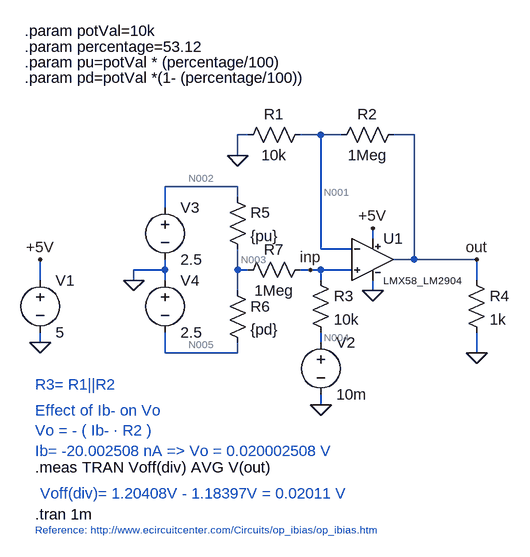
[diagram p0: schematic 05-LM358 ti bias current and offset voltage - non-inv amp.asc]
05-LM358 ti bias current and offset voltage - non-inv amp.asc, the LTspice schematic file:
Version 4
SHEET 1 880 688
WIRE 160 32 144 32
WIRE 272 32 240 32
WIRE 304 32 272 32
WIRE 416 32 384 32
WIRE 144 64 144 32
WIRE 144 112 32 112
WIRE 144 128 144 112
WIRE 32 144 32 112
WIRE 352 192 352 176
WIRE 272 208 272 32
WIRE 320 208 272 208
WIRE 416 224 416 32
WIRE 416 224 384 224
WIRE 512 224 416 224
WIRE 32 240 32 224
WIRE 32 240 -16 240
WIRE 144 240 144 208
WIRE 160 240 144 240
WIRE 256 240 240 240
WIRE 272 240 256 240
WIRE 320 240 272 240
WIRE -160 256 -160 224
WIRE -16 256 -16 240
WIRE 32 256 32 240
WIRE 272 256 272 240
WIRE 512 256 512 224
WIRE 144 272 144 240
WIRE 352 272 352 256
WIRE -160 352 -160 336
WIRE 272 352 272 336
WIRE 32 368 32 336
WIRE 144 368 144 352
WIRE 144 368 32 368
WIRE 512 368 512 336
WIRE 272 448 272 432
FLAG -160 224 +5V
FLAG 352 176 +5V
FLAG 272 448 0
FLAG 512 368 0
FLAG 512 224 out
FLAG 256 240 inp
FLAG 144 64 0
FLAG -160 352 0
FLAG 352 272 0
FLAG -16 256 0
SYMBOL voltage -160 240 R0
WINDOW 123 0 0 Left 0
WINDOW 39 0 0 Left 0
SYMATTR InstName V1
SYMATTR Value 5
SYMBOL voltage 272 336 R0
WINDOW 123 0 0 Left 0
WINDOW 39 0 0 Left 0
SYMATTR InstName V2
SYMATTR Value 10m
SYMBOL res 496 240 R0
SYMATTR InstName R4
SYMATTR Value 1k
SYMBOL res 400 16 R90
WINDOW 0 0 56 VBottom 2
WINDOW 3 32 56 VTop 2
SYMATTR InstName R2
SYMATTR Value 1Meg
SYMBOL res 256 16 R90
WINDOW 0 0 56 VBottom 2
WINDOW 3 32 56 VTop 2
SYMATTR InstName R1
SYMATTR Value 10k
SYMBOL res 256 240 R0
SYMATTR InstName R3
SYMATTR Value 10k
SYMBOL LMX58_ti 320 208 R0
WINDOW 3 48 48 Left 1
SYMATTR InstName U1
SYMBOL voltage 32 128 R0
WINDOW 123 0 0 Left 0
WINDOW 39 0 0 Left 0
SYMATTR InstName V3
SYMATTR Value 2.5
SYMBOL voltage 32 240 R0
WINDOW 123 0 0 Left 0
WINDOW 39 0 0 Left 0
SYMATTR InstName V4
SYMATTR Value 2.5
SYMBOL res 256 224 R90
WINDOW 0 0 56 VBottom 2
WINDOW 3 32 56 VTop 2
SYMATTR InstName R7
SYMATTR Value 1Meg
SYMBOL res 128 112 R0
SYMATTR InstName R5
SYMATTR Value {pu}
SYMBOL res 128 256 R0
SYMATTR InstName R6
SYMATTR Value {pd}
TEXT -168 616 Left 2 !.tran 1m
TEXT -168 416 Left 2 ;R3= R1||R2
TEXT -168 456 Left 2 ;Effect of Ib- on Vo\nVo = - ( Ib- ∙ R2 )\nIb= -20.002508 nA => Vo = 0.020002508 V
TEXT -168 544 Left 2 !.meas TRAN Voff(div) AVG V(out)
TEXT -160 584 Left 2 ;Voff(div)= 1.20408V - 1.18397V = 0.02011 V
TEXT -168 640 Left 1 ;Reference: http://www.ecircuitcenter.com/Circuits/op_ibias/op_ibias.htm
TEXT -184 -128 Left 2 !.param potVal=10k
TEXT -184 -104 Left 2 !.param percentage=53.12
TEXT -184 -80 Left 2 !.param pu=potVal * (percentage/100)
TEXT -184 -56 Left 2 !.param pd=potVal *(1- (percentage/100))

The netlist it stands for:
* 05-LM358 ti bias current and offset voltage - non-inv amp.asc
V1 +5V 0 5
V2 N004 0 10m
R4 out 0 1k
R2 out N001 1Meg
R1 N001 0 10k
R3 inp N004 10k
XU1 inp N001 +5V 0 out LMX58_LM2904  ; pins In+ In- V+ V- OUT
V3 N002 0 2.5
V4 0 N005 2.5
R7 inp N003 1Meg
R5 N002 N003 {pu}
R6 N003 N005 {pd}
.tran 1m
* R3= R1||R2
* Effect of Ib- on Vo
* Vo = - ( Ib- ∙ R2 )
* Ib= -20.002508 nA => Vo = 0.020002508 V
.meas TRAN Voff(div) AVG V(out)
* Voff(div)= 1.20408V - 1.18397V = 0.02011 V
* Reference: http://www.ecircuitcenter.com/Circuits/op_ibias/op_ibias.htm
.param potVal=10k
.param percentage=53.12
.param pu=potVal * (percentage/100)
.param pd=potVal *(1- (percentage/100))
.lib C:\Users\HoP\Documents\GitHub\LTspice\02-offset voltage - bias & offset current\02-LM358\lmx58_lm2904_ti.lib
.backanno
.end

* Results of the author's LTspice run, read from the files saved beside the schematic
* Operating Point, zero values left out:
*   V(+5v) = 5 V
*   V(n004) = 10 mV
*   V(out) = 1.039 V
*   V(n001) = 10.47 mV
*   V(inp) = 8.559 mV
*   V(n002) = 2.5 V
*   V(n005) = -2.5 V
*   V(n003) = -155.6 mV
*   I(R6) = 500.1 µA
*   I(R5) = 499.9 µA
*   I(R7) = 164.1 nA
*   I(R3) = -144.1 nA
*   I(R1) = 1.047 µA
*   I(R2) = 1.029 µA
*   I(R4) = 1.039 mA
*   I(V4) = -500.1 µA
*   I(V3) = -499.9 µA
*   I(V2) = -144.1 nA
*   I(V1) = -1.39 mA
*   Ix(u1:IN+) = -20 nA
*   Ix(u1:IN-) = -18 nA
*   Ix(u1:VCC) = 1.39 mA
*   Ix(u1:VEE) = -350 µA
*   Ix(u1:OUT) = -1.04 mA